# Altium schematic sheet YA-S-Blocks-V1.0.SchDoc: Yet Another IoT BroadRouter
size A4; Revision: 1.0; SheetNumber: 1; SheetTotal: 5
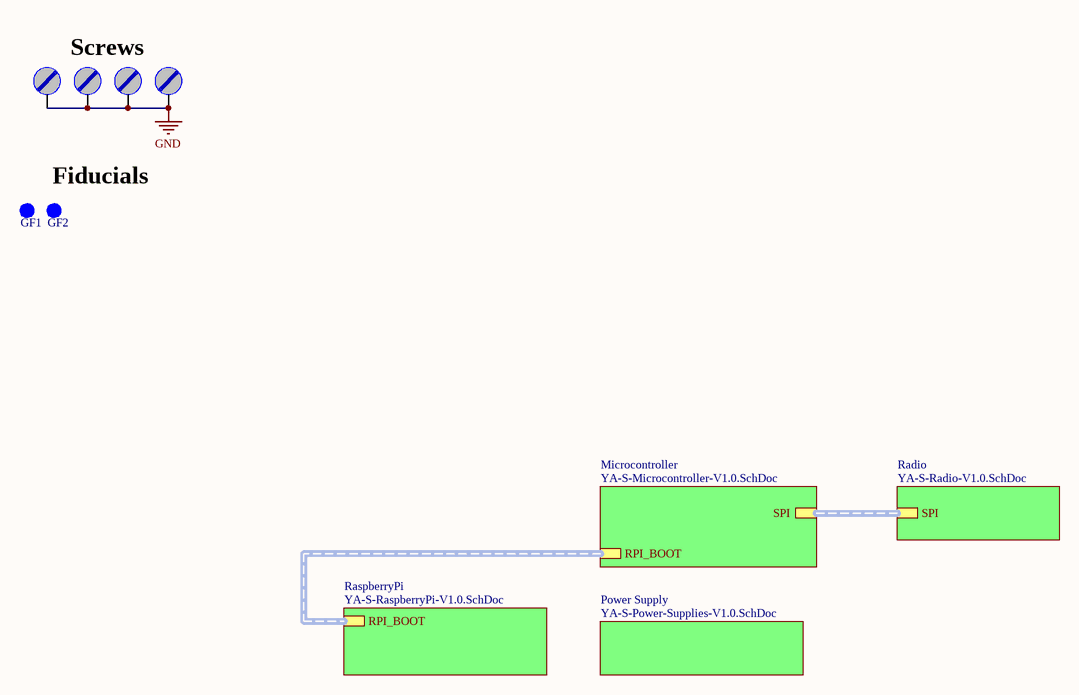
[diagram p0: YA-S-Blocks-V1.0.SchDoc]

## Parts
GF1  Fiducial  [FIDUCIAL 1mm]  (value not drawn)  (no BOM)
GF2  Fiducial  [FIDUCIAL 1mm]  (value not drawn)  (no BOM)
M1  Furo de Fixação  [Furo_M3]  (value not drawn)  (no BOM)
M2  Furo de Fixação  [Furo_M3]  (value not drawn)  (no BOM)
M3  Furo de Fixação  [Furo_M3]  (value not drawn)  (no BOM)
M4  Furo de Fixação  [Furo_M3]  (value not drawn)  (no BOM)

## Sub-sheets
Microcontroller = YA-S-Microcontroller-V1.0.SchDoc: SPI (harness SPI), RPI_BOOT (harness RPI_BOOT)
Power Supply = YA-S-Power-Supplies-V1.0.SchDoc: no entries
Radio = YA-S-Radio-V1.0.SchDoc: SPI (harness SPI)
RaspberryPi = YA-S-RaspberryPi-V1.0.SchDoc: RPI_BOOT (harness RPI_BOOT)

## Nets
GND: M1.X M2.X M3.X M4.X

## Buses and harness runs
harness sheet Microcontroller/RPI_BOOT = sheet RaspberryPi/RPI_BOOT
harness sheet Microcontroller/SPI = sheet Radio/SPI

## Notes on the sheet
- Screws
- Fiducials
- Projeto:
- Tamanho:
- Data:
- A4
- Eng. Felipe Navarro
- Hora:
- Revisão:
- Folha
- de
- Arquivo:

## Library data of the parts
GF1 GF2 = Fiducial: Guia Fiducial; ChinesePrice: 0,00000; Chinês: ----; Corrente: *; Potência: *; Supplier 1: Digi-Key; Supplier Part Number 1: --Del; Tensão: *; Value: *; Obs:: *; Tolerância: *; ComponentLink1Description: Datasheet; ComponentLink1URL: D:\Tecnoclade\Datasheet\
M1-M4 = Parafuso: Furo para parafuso; Value: M3; ChinesePrice: 0,00000; Chinês: ----; Supplier 1: Digi-Key; Supplier Part Number 1: --Del; Corrente: *; Potência: *; Tensão: *; Tolerância: *; Obs:: *; ComponentLink1Description: Datasheet; ComponentLink1URL: D:\Tecnoclade\Datasheet\!DataMissing.pdf